# Altium schematic sheet 3. 4G.SchDoc: 4G
size A4
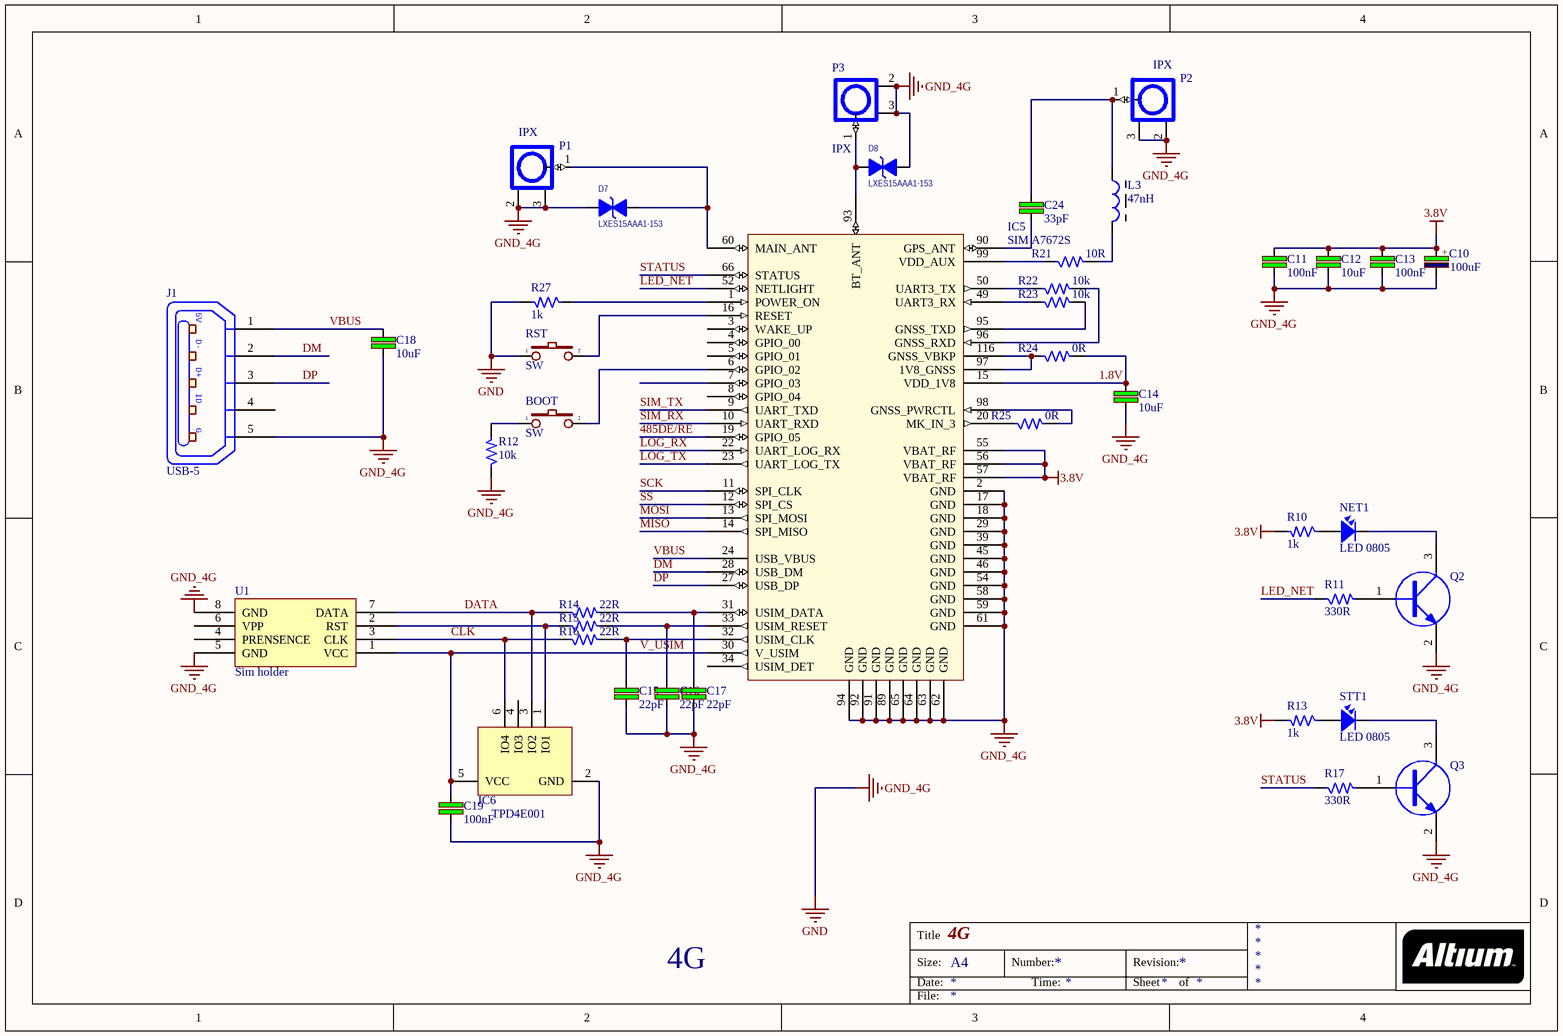
[diagram p0: 3. 4G.SchDoc]

## Parts
BOOT  SW  [SW1-SMD]
C10  100uF  [EEFSDE]
C11  100nF  [C-0805]
C12  10uF  [C-0805]
C13  100nF  [C-0805]
C14  10uF  [C-0805]
C15  22pF  [C-0805]
C16  22pF  [C-0805]
C17  22pF  [C-0805]
C18  10uF  [C-0805]
C19  100nF  [C-0805]
C24  33pF  [C-0805]
D7  LXES15AAA1-153  [R-0402]
D8  LXES15AAA1-153  [R-0402]
IC5  SIM A7672S  [SIM A7672S]
IC6  TPD4E001  [SOT23-6 - 2]
J1  USB-5  [USB-M1]
L3  47nH  [L-0603]
NET1  LED 0805  [LED-0805]
P1  IPX  [IPXS]
P2  IPX  [IPXS]
P3  IPX  [IPXS]
Q2  C1815(MMBT4401)  [SOT23-3]  (value not drawn)
Q3  C1815(MMBT4401)  [SOT23-3]  (value not drawn)
R10  1k  [R-0805]
R11  330R  [R-0805]
R12  10k  [R-0805]
R13  1k  [R-0805]
R14  22R  [R-0805]
R15  22R  [R-0805]
R16  22R  [R-0805]
R17  330R  [R-0805]
R21  10R  [R-0805]
R22  10k  [R-0805]
R23  10k  [R-0805]
R24  0R  [R-0805]
R25  0R  [R-0805]
R27  1k  [R-0805]
RST  SW  [SW1-SMD]
STT1  LED 0805  [LED-0805]
U1  Sim holder  [SIM_MicroSIM 6P Flip]

## Nets
3.8V: C10.1 C11.1 C12.1 C13.1 IC5.55(VBAT_RF) IC5.56(VBAT_RF) IC5.57(VBAT_RF) R10.2 R13.2
GND: C10.2 C11.2 C12.2 C13.2 C14.2 C15.2 C16.2 C17.2 C18.2 C19.2 D7.2(K) D8.1(A) IC5.2(GND) IC5.17(GND) IC5.18(GND) IC5.29(KEYPAD_0) IC5.39(GND) IC5.45(GND) IC5.46(ADC2) IC5.54(GPIO4) IC5.58(GND) IC5.59(GND) IC5.61(GND) IC5.62(GND) IC5.63(GND) IC5.64(GND) IC5.65(GND) IC5.89(GND) IC5.91(GND) IC5.92(GND) IC5.94(GND) IC6.2(GND) J1.5(P5) P1.2 P1.3 P2.2 P2.3 P3.2 P3.3 Q2.2(E) Q3.2(E) R12.1 R27.2 RST.1 U1.5(GND) U1.8(GND)  [also labelled GND_4G]
1.8V: C14.1 IC5.15(RESERVED) R24.2
485DE/RE: IC5.19(GPIO_05)
CLK: IC6.6(IO4) R16.1 U1.3(CLK)
DATA: IC6.3(IO2) R14.1 U1.7(DATA)
DM: IC5.28(KEYSENSE_N0) J1.2(P2)
DP: IC5.27(KEYSENSE_N1) J1.3(P3)
LED_NET: IC5.52(GPIO41) R11.1
LOG_RX: IC5.22(SPK_P)
LOG_TX: IC5.23(MIC1P)
MISO: IC5.14(SPI_MISO)
MOSI: IC5.13(SPI_MOSI)
SCK: IC5.11(SPI_CLK)
SIM_RX: IC5.10(UART_RXD)
SIM_TX: IC5.9(UART_TXD)
SS: IC5.12(SPI_CS)
STATUS: IC5.66(STATUS) R17.1
V_USIM: C19.1 IC5.30(KEYPAD_2) IC6.5(VCC) U1.1(VCC)
VBUS: C18.1 IC5.24(MIC1N) J1.1(P1)
NetBOOT_1: BOOT.1 R12.2
NetBOOT_2: BOOT.2 IC5.6(GPIO_02)
NetC15_1: C15.1 IC5.32(KEYSENSE_N3) R16.2
NetC16_1: C16.1 IC5.33(KEYPAD_1) R15.2
NetC17_1: C17.1 IC5.31(KEYSENSE_N2) R14.2
NetC24_1: C24.1 IC5.90(GPS_ANT)
NetC24_2: C24.2 L3.1 P2.1
NetD7_1: D7.1(A) IC5.60(MAIN_ANT) P1.1
NetD8_2: D8.2(K) IC5.93(BT_ANT) P3.1
NetIC5_1: IC5.1(POWER_ON) R27.1
NetIC5_16: IC5.16(RESERVED) RST.2
NetIC5_20: IC5.20(MK_IN_3) R25.1
NetIC5_49: IC5.49(GPIO40) R23.1
NetIC5_50: IC5.50(GPIO43) R22.1
NetIC5_95: IC5.95(GNSS_TXD) R23.2
NetIC5_96: IC5.96(GNSS_RXD) R22.2
NetIC5_97: IC5.97(1V8_GNSS) IC5.116(GNSS_VBKP) R24.1
NetIC5_98: IC5.98(GNSS_PWRCTL) R25.2
NetIC5_99: IC5.99(VDD_AUX) R21.1
NetIC6_1: IC6.1(IO1) R15.1 U1.2(RST)
NetL3_2: L3.2 R21.2
NetNET1_1: NET1.1 R10.1
NetNET1_2: NET1.2 Q2.3(C)
NetQ2_1: Q2.1(B) R11.2
NetQ3_1: Q3.1(B) R17.2
NetQ3_3: Q3.3(C) STT1.2
NetR13_1: R13.1 STT1.1

Not connected (* = marked no-connect by the designer): IC5 3(WAKE_UP) 4(GPIO_00) 5(GPIO_01) 7(GPIO_03) 8(GPIO_04) 21(SPK_M) 25(EAR1N) 26(EAR1P) 34(KEYPAD_4) 35(KEYPAD_3) 36(KEYSENSE_N4) 47(ADC1) 48(GPIO44) 51(GPIO1) 53(GPIO42) 73(PCM_DOUT) 74(PCM_DIN) 75(PCM_SYNC) 76(PCM_CLK); IC6 4(IO3); J1 4(P4); U1 4(PRENSENCE) 6(VPP)

## Notes on the sheet
- 4G
- Title
- Size:
- Date:
- A4
- Number:
- Time:
- Revision:
- Sheet
- of
- File:
- (in symbol CP4) +
- (in symbol USB-5) 5V; D-; D+; ID; G

## Library data of the parts
BOOT RST = SW2: Switch button 2 pin; Value: SW chip 2 pin
C10 = CP4: Cap SMD; Manufacturer: Samsung Electro-Mechanics; Part number: TCME227M016R0040E; User_Description: CAP TANT POLY 220UF 16V 2917; Category: CAPACITOR; Package: 0805
C11 C13 C19 = C: Cap SMD; Manufacturer: Samsung Electro-Mechanics; Part number: CL21B104KBCNNWC; User_Description: CAP CER 0.1UF 50V X7R 0805; Value: 100nF; Category: CAPACITOR; Package: 0805
C12 C14 C18 = C: Cap SMD; Manufacturer: Samsung Electro-Mechanics; Part number: CL21A106KPFNNNG; User_Description: CAP CER 10UF 10V X5R 0805; Value: 10uF; Category: CAPACITOR; Package: 0805
C15-C17 = C: Cap SMD; Manufacturer: Samsung Electro-Mechanics; Part number: CL21C220JBANFNC; User_Description: CAP CER 22PF 50V C0G/NP0 0805; Value: 22pF; Category: CAPACITOR; Package: 0805
C24 = C: Cap SMD; Manufacturer: Samsung Electro-Mechanics; Part number: CC0805FRNPO9BN330; User_Description: CAP CER 33PF 50V NPO 0805; Value: 33pF; Category: CAPACITOR; Package: 0805
D7 D8 = TVS: TVS DIODE 4VWM 1005; Manufacturer: Murata Electronics; Value: 4V; Category: Circuit Protection; Package: 0402; Part number: LXES15AAA1-153; User_Description: TVS DIODE 4VWM 1005
IC5 = SIM A7672S: SIM A7672S-CAT-M1; Part number: SIM A7672S
IC6 = TPD4E001: Manufacturer: Texas Instruments; Part number: TPD4E001RDBVR; User_Description: TVS DIODE 5.5VWM SC70-6; Category: Circuit Protection; Package: SOT-363
J1 = USB-5: Manufacturer: FCI; Category: Connectors, Interconnects
L3 = Inductor Ferit: FIXED IND 47NH 300MA 700MOHM SMD; Manufacturer: Taiyo Yuden; Part number: HK160847NJ-T; Value: 150 mH; Category: INDUCTORS; Package: 0603; User_Description: FIXED IND 47NH 300MA 700MOHM SMD
NET1 STT1 = LED: LED RED DIFFUSED 0805 SMD; Manufacturer: OSRAM Opto Semiconductors Inc.; Part number: LS R976-NR-1; Value: Red; Category: LED SMD; Package: 0805; User_Description: LED RED DIFFUSED 0805 SMD
P1-P3 = IPXSx66: Antenna GSM GPS; Manufacturer: TE Connectivity AMP Connectors; Part number: 2334884-1; User_Description: UMCC MICRO-COAX RECEPTACLE, GEN; Category: Connectors; Package: SMD
Q2 Q3 = NPN: Transistor C1815, SOT23; Manufacturer: Fairchild Semiconductor; User_Description: 0.6A, 40V, NPN; Category: TRAN NPN; Package: SOT-23; Part number: MMBT4401
R10 R13 R27 = R: Resistor 1/4W; Manufacturer: Yageo; Part number: RC0805FR-071KL; User_Description: RES SMD 1K OHM 1% 1/8W 0805; Value: 1k; Category: RESISTORS; Package: 0805
R11 R17 = R: Resistor 1/4W; Manufacturer: Yageo; Part number: RC0805FR-07330RL; User_Description: RES SMD 330 OHM 1% 1/8W 0805; Category: RESISTORS; Package: 0805; Value: 330R
R12 = R: Resistor 1/4W; Manufacturer: Yageo; Part number: RC0805FR-0710KL; User_Description: RES SMD 10K OHM 1% 1/8W 0805; Category: RESISTORS; Package: 0805; Value: 10k
R14-R16 = R: Resistor 1/4W; Manufacturer: Yageo; Part number: RC0805FR-0722RL; User_Description: RES SMD 22 OHM 1% 1/8W 0805; Category: RESISTORS; Package: 0805; Value: 22R
R21 = R: Resistor 1/4W; Manufacturer: Yageo; Part number: RC0805FR-0710RL; User_Description: RES SMD 10 OHM 1% 1/8W 0805; Category: RESISTORS; Package: 0805; Value: 10R
R22-R25 = R: Resistor 1/4W; Manufacturer: Yageo; Part number: RC0805FR-0710RL; User_Description: RES SMD 10 OHM 1% 1/8W 0805; Value: 10R; Category: RESISTORS; Package: 0805
U1 = Component_1